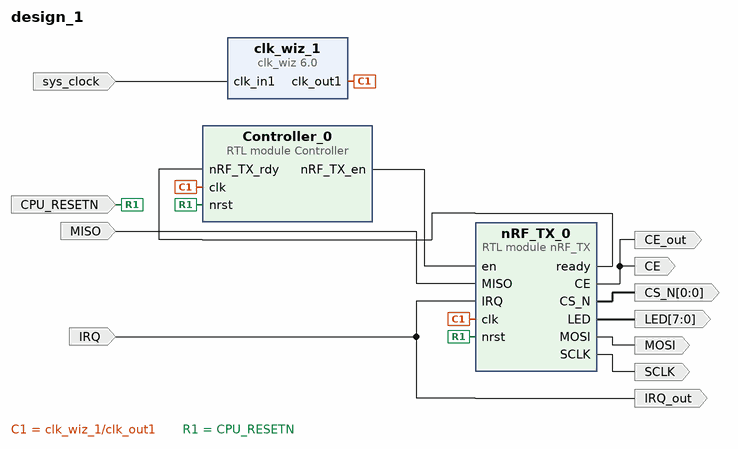
[diagram p0: block diagram of the top level]
# Vivado block design design_1, xc7a100tcsg324-1, Vivado 2020.2
create_bd_design design_1

create_bd_port -dir I -type clk sys_clock
set_property -dict {CONFIG.FREQ_HZ 100000000 CONFIG.PHASE 0.000} [get_bd_ports sys_clock]
create_bd_port -dir I -type rst CPU_RESETN
create_bd_port -dir O -from 0 -to 0 CS_N
create_bd_port -dir O SCLK
create_bd_port -dir O MOSI
create_bd_port -dir O CE
create_bd_port -dir I -type intr IRQ
create_bd_port -dir I MISO
create_bd_port -dir O IRQ_out
create_bd_port -dir O CE_out
create_bd_port -dir O -from 7 -to 0 LED

create_bd_cell -type ip -vlnv xilinx.com:ip:clk_wiz:6.0 clk_wiz_1
set_property -dict [list \
  CONFIG.CLK_IN1_BOARD_INTERFACE sys_clock \
  CONFIG.USE_BOARD_FLOW true \
  CONFIG.USE_LOCKED false \
  CONFIG.USE_RESET false \
] [get_bd_cells clk_wiz_1]
create_bd_cell -type module -reference nRF_TX nRF_TX_0
create_bd_cell -type module -reference Controller Controller_0

# ---- connections ----

connect_bd_net [get_bd_pins clk_wiz_1/clk_out1] [get_bd_pins nRF_TX_0/clk] [get_bd_pins Controller_0/clk]
connect_bd_net [get_bd_ports sys_clock] [get_bd_pins clk_wiz_1/clk_in1]
connect_bd_net [get_bd_ports CPU_RESETN] [get_bd_pins nRF_TX_0/nrst] [get_bd_pins Controller_0/nrst]
connect_bd_net [get_bd_pins Controller_0/nRF_TX_en] [get_bd_pins nRF_TX_0/en]
connect_bd_net [get_bd_pins nRF_TX_0/ready] [get_bd_pins Controller_0/nRF_TX_rdy]
connect_bd_net [get_bd_pins nRF_TX_0/CS_N] [get_bd_ports CS_N]
connect_bd_net [get_bd_pins nRF_TX_0/SCLK] [get_bd_ports SCLK]
connect_bd_net [get_bd_pins nRF_TX_0/MOSI] [get_bd_ports MOSI]
connect_bd_net [get_bd_pins nRF_TX_0/CE] [get_bd_ports CE] [get_bd_ports CE_out]
connect_bd_net -net IRQ_0_1 [get_bd_ports IRQ] [get_bd_ports IRQ_out] [get_bd_pins nRF_TX_0/IRQ]
connect_bd_net -net MISO_0_1 [get_bd_ports MISO] [get_bd_pins nRF_TX_0/MISO]
connect_bd_net [get_bd_pins nRF_TX_0/LED] [get_bd_ports LED]

validate_bd_design
save_bd_design
